# Altium schematic sheet RelayBoard.SchDoc
size A1
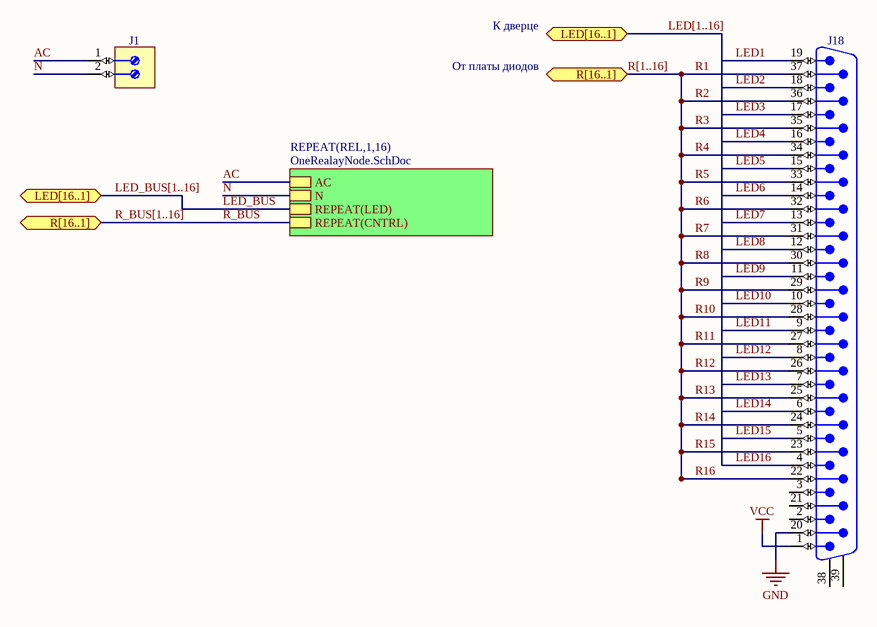
[diagram p0: RelayBoard.SchDoc]

## Parts
J1  Terminal  [WIELAND_25.161.0253.0]  (value not drawn)
J18  D-Sub  [AMPHENOL_L717DFC37P1ATN]  (value not drawn)

## Sub-sheets
REPEAT(REL,1,16) = OneRealayNode.SchDoc: AC, N, REPEAT(LED), REPEAT(CNTRL)

## Ports
LED[16..1], R[16..1]

## Nets
GND: J18.20
VCC: J18.1
AC: J1.1 ; sheet REPEAT(REL,1,16)/AC
LED1: J18.19
LED2: J18.18
LED3: J18.17
LED4: J18.16
LED5: J18.15
LED6: J18.14
LED7: J18.13
LED8: J18.12
LED9: J18.11
LED10: J18.10
LED11: J18.9
LED12: J18.8
LED13: J18.7
LED14: J18.6
LED15: J18.5
LED16: J18.4
LED_BUS: sheet REPEAT(REL,1,16)/REPEAT(LED)
N: J1.2 ; sheet REPEAT(REL,1,16)/N
R1: J18.37
R2: J18.36
R3: J18.35
R4: J18.34
R5: J18.33
R6: J18.32
R7: J18.31
R8: J18.30
R9: J18.29
R10: J18.28
R11: J18.27
R12: J18.26
R13: J18.25
R14: J18.24
R15: J18.23
R16: J18.22
R_BUS: sheet REPEAT(REL,1,16)/REPEAT(CNTRL)

Not connected (* = marked no-connect by the designer): J18 2 3 21 38 39

## Buses and harness runs
bus LED[1..16] = port LED[16..1]
bus LED_BUS[1..16] = port LED[16..1]
bus R[1..16] = port R[16..1]
bus R_BUS[1..16] = port R[16..1]

## Notes on the sheet
- К дверце
- От платы диодов

## Library data of the parts
J1 = WIELAND_25.161.0253.0: Terminal Block, 2 Positions, Screw Connection; Part Description: 16A 250VAC 2 Way PCB Terminal Block, Pitch 5mm, Screw Connection, Wire Size Max: 2.5mm²; Table: Miscellaneous; Part Number: WIELAND_25.161.0253.0; Component Kind: Standard; Component Type: Standard; Pin Count: 3; Family: Terminal; Mounted: Yes; Socket: No; SMD: No; Status: None; Manufacturer: WIELAND; Manufacturer Part Number: 25.161.0253.0; ComponentHeight: 15mm; HelpURL: \\cern.ch\dfs\Applications\Altium\Datasheets\WIELAND_25.161.0253.0.pdf; Author: CERN DEM JLC; CreateDate: 03.06.2009; LatestRevisionDate: 03.06.2009
J18 = AMPHENOL_L717DFC37P1ATN: Connector D-sub 37 Male; Part Description: Right Angled D-Sub 37 Male Contacts with Metal Bracket and Front Female Screwlock (UNC4-40); Part Number: AMPHENOL_L717DFC37P1ATN; Component Kind: Standard; Component Type: Standard; Pin Count: 39; Family: D-Sub; Mounted: Yes; Socket: No; SMD: No; Status: None; Manufacturer: AMPHENOL; Manufacturer Part Number: L717DFC37P1ATN; ComponentHeight: 13.4mm; HelpURL: \\cern.ch\dfs\Applications\Altium\Datasheets\AMPHENOL_L717DFC37P1ATN.pdf; Author: CERN DEM JLC; CreateDate: 27.09.2012; LatestRevisionDate: 27.09.2012; Table: AMPHENOL